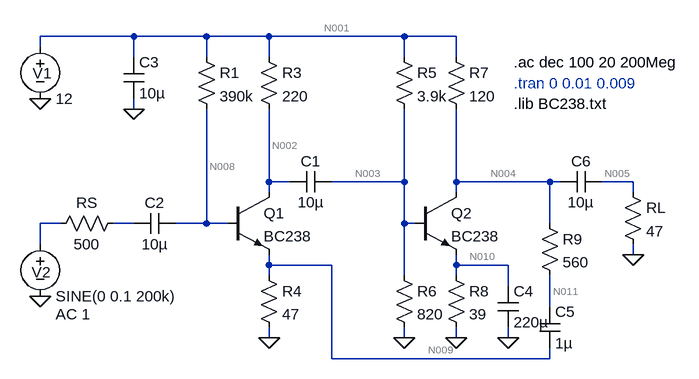
[diagram p0: schematic first.asc]
first.asc, the LTspice schematic file:
Version 4
SHEET 1 880 680
WIRE -128 -128 -272 -128
WIRE -16 -128 -128 -128
WIRE 80 -128 -16 -128
WIRE 288 -128 80 -128
WIRE 368 -128 288 -128
WIRE -272 -112 -272 -128
WIRE -128 -96 -128 -128
WIRE -16 -96 -16 -128
WIRE 80 -96 80 -128
WIRE 288 -96 288 -128
WIRE 368 -96 368 -128
WIRE -128 -16 -128 -32
WIRE 80 96 80 -16
WIRE 112 96 80 96
WIRE 288 96 288 -16
WIRE 288 96 176 96
WIRE 368 96 368 -16
WIRE 512 96 368 96
WIRE 528 96 512 96
WIRE 640 96 592 96
WIRE 80 112 80 96
WIRE 368 112 368 96
WIRE 640 112 640 96
WIRE -240 160 -272 160
WIRE -128 160 -160 160
WIRE -16 160 -16 -16
WIRE -16 160 -64 160
WIRE 16 160 -16 160
WIRE 288 160 288 96
WIRE 304 160 288 160
WIRE 512 160 512 96
WIRE -272 192 -272 160
WIRE 640 208 640 192
WIRE 80 224 80 208
WIRE 176 224 80 224
WIRE 368 224 368 208
WIRE 448 224 368 224
WIRE 80 240 80 224
WIRE 288 240 288 160
WIRE 368 240 368 224
WIRE 448 256 448 224
WIRE 512 288 512 240
WIRE 80 336 80 320
WIRE 288 336 288 320
WIRE 368 336 368 320
WIRE 448 336 448 320
WIRE 176 368 176 224
WIRE 512 368 512 352
WIRE 512 368 176 368
FLAG 640 208 0
FLAG 80 336 0
FLAG 288 336 0
FLAG 368 336 0
FLAG 448 336 0
FLAG -128 -16 0
FLAG -272 272 0
FLAG -272 -32 0
SYMBOL npn 16 112 R0
SYMATTR InstName Q1
SYMATTR Value BC238
SYMBOL npn 304 112 R0
SYMATTR InstName Q2
SYMATTR Value BC238
SYMBOL cap 176 80 R90
WINDOW 0 0 32 VBottom 2
WINDOW 3 32 32 VTop 2
SYMATTR InstName C1
SYMATTR Value 10µ
SYMBOL res 272 224 R0
SYMATTR InstName R6
SYMATTR Value 820
SYMBOL res 272 -112 R0
SYMATTR InstName R5
SYMATTR Value 3.9k
SYMBOL res -32 -112 R0
SYMATTR InstName R1
SYMATTR Value 390k
SYMBOL cap -64 144 R90
WINDOW 0 0 32 VBottom 2
WINDOW 3 32 32 VTop 2
SYMATTR InstName C2
SYMATTR Value 10µ
SYMBOL cap -144 -96 R0
SYMATTR InstName C3
SYMATTR Value 10µ
SYMBOL res 352 -112 R0
SYMATTR InstName R7
SYMATTR Value 120
SYMBOL res 64 224 R0
SYMATTR InstName R4
SYMATTR Value 47
SYMBOL res 64 -112 R0
SYMATTR InstName R3
SYMATTR Value 220
SYMBOL res 352 224 R0
SYMATTR InstName R8
SYMATTR Value 39
SYMBOL cap 432 256 R0
SYMATTR InstName C4
SYMATTR Value 220µ
SYMBOL res 496 144 R0
SYMATTR InstName R9
SYMATTR Value 560
SYMBOL cap 592 80 R90
WINDOW 0 0 32 VBottom 2
WINDOW 3 32 32 VTop 2
SYMATTR InstName C6
SYMATTR Value 10µ
SYMBOL res 624 96 R0
SYMATTR InstName RL
SYMATTR Value 47
SYMBOL voltage -272 -128 R0
WINDOW 0 -12 57 Left 2
WINDOW 123 0 0 Left 0
WINDOW 39 0 0 Left 0
SYMATTR InstName V1
SYMATTR Value 12
SYMBOL voltage -272 176 R0
WINDOW 0 -13 59 Left 2
WINDOW 123 24 124 Left 2
WINDOW 39 0 0 Left 0
SYMATTR InstName V2
SYMATTR Value2 AC 1
SYMATTR Value SINE(0 0.1 200k)
SYMBOL res -144 144 R90
WINDOW 0 0 56 VBottom 2
WINDOW 3 32 56 VTop 2
SYMATTR InstName RS
SYMATTR Value 500
SYMBOL cap 496 288 R0
SYMATTR InstName C5
SYMATTR Value 1µ
TEXT 456 -56 Left 2 ;.tran 0 0.01 0.009
TEXT 456 -24 Left 2 !.lib BC238.txt
TEXT 456 -88 Left 2 !.ac dec 100 20 200Meg

The netlist it stands for:
* first.asc
Q1 N002 N008 N009 0 BC238
Q2 N004 N003 N010 0 BC238
C1 N003 N002 10µ
R6 N003 0 820
R5 N001 N003 3.9k
R1 N001 N008 390k
C2 N008 N007 10µ
C3 N001 0 10µ
R7 N001 N004 120
R4 N009 0 47
R3 N001 N002 220
R8 N010 0 39
C4 N010 0 220µ
R9 N004 N011 560
C6 N005 N004 10µ
RL N005 0 47
V1 N001 0 12
V2 N006 0 SINE(0 0.1 200k) AC 1
RS N007 N006 500
C5 N011 N009 1µ
.model NPN NPN
.model PNP PNP
.lib standard.bjt
* .tran 0 0.01 0.009
.lib BC238.txt
.ac dec 100 20 200Meg
.backanno
.end

* Results of the author's LTspice run, read from the files saved beside the schematic
* Operating Point, zero values left out:
*   V(n002) = 9.985 V
*   V(n008) = 1.132 V
*   V(n009) = 431.8 mV
*   V(n004) = 8.137 V
*   V(n003) = 2.01 V
*   V(n010) = 1.26 V
*   V(n001) = 12 V
*   V(n011) = 8.137 V
*   Ic(Q1) = 9.159 mA
*   Ib(Q1) = 27.87 µA
*   Ie(Q1) = -9.187 mA
*   Ic(Q2) = 32.19 mA
*   Ib(Q2) = 109.7 µA
*   Ie(Q2) = -32.3 mA
*   I(R6) = 2.452 mA
*   I(R5) = 2.561 mA
*   I(R1) = 27.87 µA
*   I(R7) = 32.19 mA
*   I(R4) = 9.187 mA
*   I(R3) = 9.159 mA
*   I(R8) = 32.3 mA
*   I(V1) = -43.94 mA
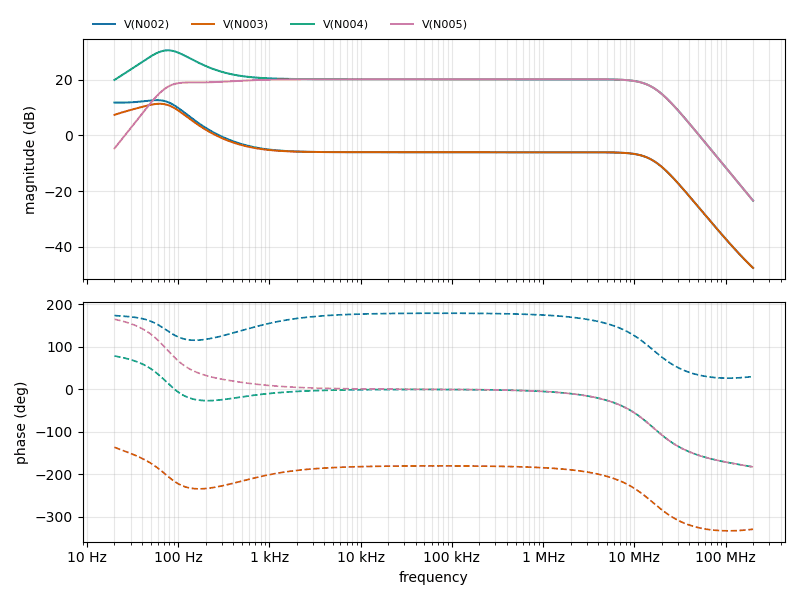
[diagram p1: AC Analysis of first.asc, plotted from the saved traces]
* AC Analysis, 1 run:
*   V(N002): 11.79 dB at 20 Hz, -47.57 dB at 200 MHz, peak 12.67 dB at 59.02 Hz, 3 dB below the peak at 102 Hz
*   V(N003): 7.39 dB at 20 Hz, -47.58 dB at 200 MHz, peak 11.38 dB at 63.25 Hz, 3 dB below the peak at 24.86 Hz and 106.2 Hz
*   V(N004): 19.92 dB at 20 Hz, -23.42 dB at 200 MHz, peak 30.56 dB at 76.04 Hz, 3 dB below the peak at 45.4 Hz and 137 Hz
*   V(N005): -4.67 dB at 20 Hz, -23.42 dB at 200 MHz, peak 20.18 dB at 144.9 kHz, 3 dB below the peak at 74.34 Hz and 16.04 MHz